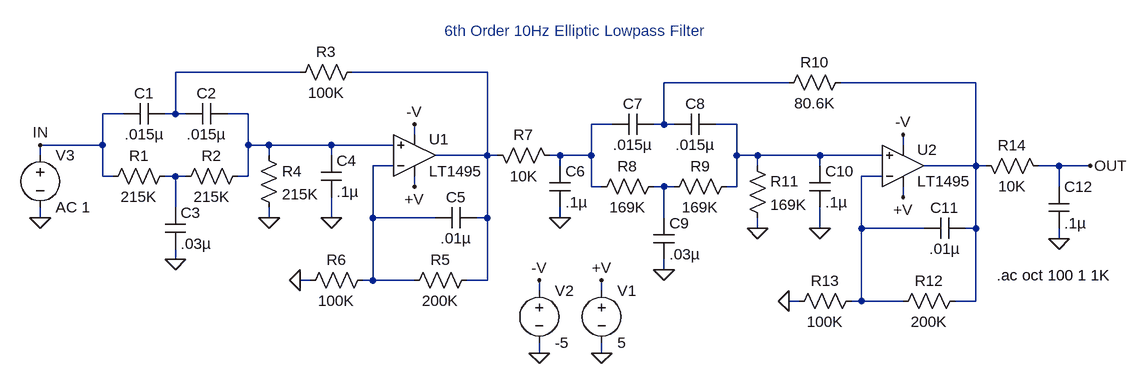
[diagram p0: schematic 1495.asc]
1495.asc, the LTspice schematic file:
Version 4
SHEET 1 1748 680
WIRE 144 -32 -48 -32
WIRE 432 -32 224 -32
WIRE 896 -16 704 -16
WIRE 1184 -16 976 -16
WIRE -128 32 -160 32
WIRE -48 32 -48 -32
WIRE -48 32 -64 32
WIRE -32 32 -48 32
WIRE 64 32 32 32
WIRE 624 48 592 48
WIRE 704 48 704 -16
WIRE 704 48 688 48
WIRE 720 48 704 48
WIRE 816 48 784 48
WIRE 320 64 320 48
WIRE -160 80 -160 32
WIRE -160 80 -256 80
WIRE 64 80 64 32
WIRE 96 80 64 80
WIRE 192 80 96 80
WIRE 288 80 192 80
WIRE 1072 80 1072 64
WIRE -256 96 -256 80
WIRE 96 96 96 80
WIRE 192 96 192 80
WIRE 432 96 432 -32
WIRE 432 96 352 96
WIRE 448 96 432 96
WIRE 544 96 528 96
WIRE 592 96 592 48
WIRE 592 96 544 96
WIRE 816 96 816 48
WIRE 848 96 816 96
WIRE 944 96 848 96
WIRE 1040 96 944 96
WIRE 288 112 256 112
WIRE 544 112 544 96
WIRE 848 112 848 96
WIRE 944 112 944 96
WIRE 1184 112 1184 -16
WIRE 1184 112 1104 112
WIRE 1200 112 1184 112
WIRE 1312 112 1280 112
WIRE 1360 112 1312 112
WIRE -160 128 -160 80
WIRE -144 128 -160 128
WIRE -48 128 -64 128
WIRE -32 128 -48 128
WIRE 64 128 64 80
WIRE 64 128 48 128
WIRE 1040 128 1008 128
WIRE 320 144 320 128
WIRE 592 144 592 96
WIRE 608 144 592 144
WIRE 704 144 688 144
WIRE 720 144 704 144
WIRE 816 144 816 96
WIRE 816 144 800 144
WIRE 1312 144 1312 112
WIRE 1072 160 1072 144
WIRE -48 176 -48 128
WIRE -256 192 -256 176
WIRE 96 192 96 176
WIRE 192 192 192 160
WIRE 256 192 256 112
WIRE 352 192 256 192
WIRE 432 192 432 96
WIRE 432 192 416 192
WIRE 544 192 544 176
WIRE 704 192 704 144
WIRE 848 208 848 192
WIRE 944 208 944 176
WIRE 1008 208 1008 128
WIRE 1104 208 1008 208
WIRE 1184 208 1184 112
WIRE 1184 208 1168 208
WIRE 1312 224 1312 208
WIRE -48 256 -48 240
WIRE 704 272 704 256
WIRE 160 288 144 288
WIRE 256 288 256 192
WIRE 256 288 240 288
WIRE 320 288 256 288
WIRE 432 288 432 192
WIRE 432 288 400 288
WIRE 512 304 512 288
WIRE 608 304 608 288
WIRE 912 320 896 320
WIRE 1008 320 1008 208
WIRE 1008 320 992 320
WIRE 1072 320 1008 320
WIRE 1184 320 1184 208
WIRE 1184 320 1152 320
WIRE 512 400 512 384
WIRE 608 400 608 384
FLAG 608 400 0
FLAG 320 144 +V
FLAG 608 288 +V
FLAG 320 48 -V
FLAG 512 400 0
FLAG 512 288 -V
FLAG -48 256 0
FLAG -256 192 0
FLAG 192 192 0
FLAG 96 192 0
FLAG 144 288 0
FLAG 1072 160 +V
FLAG 1072 64 -V
FLAG 704 272 0
FLAG 944 208 0
FLAG 848 208 0
FLAG 896 320 0
FLAG 1312 224 0
FLAG 1360 112 OUT
FLAG -256 80 IN
FLAG 544 192 0
SYMBOL voltage 608 288 R0
SYMATTR InstName V1
SYMATTR Value 5
SYMBOL voltage 512 288 R0
SYMATTR InstName V2
SYMATTR Value -5
SYMBOL cap -64 16 R90
WINDOW 0 0 32 VBottom 2
WINDOW 3 32 32 VTop 2
SYMATTR InstName C1
SYMATTR Value .015µ
SYMBOL cap 32 16 R90
WINDOW 0 0 32 VBottom 2
WINDOW 3 32 32 VTop 2
SYMATTR InstName C2
SYMATTR Value .015µ
SYMBOL res -48 112 R90
WINDOW 0 0 56 VBottom 2
WINDOW 3 32 56 VTop 2
SYMATTR InstName R1
SYMATTR Value 215K
SYMBOL res 64 112 R90
WINDOW 0 0 56 VBottom 2
WINDOW 3 32 56 VTop 2
SYMATTR InstName R2
SYMATTR Value 215K
SYMBOL cap -64 176 R0
SYMATTR InstName C3
SYMATTR Value .03µ
SYMBOL res 240 -48 R90
WINDOW 0 0 56 VBottom 2
WINDOW 3 32 56 VTop 2
SYMATTR InstName R3
SYMATTR Value 100K
SYMBOL res 80 80 R0
SYMATTR InstName R4
SYMATTR Value 215K
SYMBOL cap 176 96 R0
SYMATTR InstName C4
SYMATTR Value .1µ
SYMBOL res 416 272 R90
WINDOW 0 0 56 VBottom 2
WINDOW 3 32 56 VTop 2
SYMATTR InstName R5
SYMATTR Value 200K
SYMBOL res 256 272 R90
WINDOW 0 0 56 VBottom 2
WINDOW 3 32 56 VTop 2
SYMATTR InstName R6
SYMATTR Value 100K
SYMBOL cap 416 176 R90
WINDOW 0 0 32 VBottom 2
WINDOW 3 32 32 VTop 2
SYMATTR InstName C5
SYMATTR Value .01µ
SYMBOL voltage -256 80 R0
SYMATTR InstName V3
SYMATTR Value AC 1
SYMBOL res 432 80 M90
WINDOW 0 0 56 VBottom 2
WINDOW 3 32 56 VTop 2
SYMATTR InstName R7
SYMATTR Value 10K
SYMBOL cap 528 112 R0
SYMATTR InstName C6
SYMATTR Value .1µ
SYMBOL cap 688 32 R90
WINDOW 0 0 32 VBottom 2
WINDOW 3 32 32 VTop 2
SYMATTR InstName C7
SYMATTR Value .015µ
SYMBOL cap 784 32 R90
WINDOW 0 0 32 VBottom 2
WINDOW 3 32 32 VTop 2
SYMATTR InstName C8
SYMATTR Value .015µ
SYMBOL res 704 128 R90
WINDOW 0 0 56 VBottom 2
WINDOW 3 32 56 VTop 2
SYMATTR InstName R8
SYMATTR Value 169K
SYMBOL res 816 128 R90
WINDOW 0 0 56 VBottom 2
WINDOW 3 32 56 VTop 2
SYMATTR InstName R9
SYMATTR Value 169K
SYMBOL cap 688 192 R0
SYMATTR InstName C9
SYMATTR Value .03µ
SYMBOL res 992 -32 R90
WINDOW 0 0 56 VBottom 2
WINDOW 3 32 56 VTop 2
SYMATTR InstName R10
SYMATTR Value 80.6K
SYMBOL res 832 96 R0
SYMATTR InstName R11
SYMATTR Value 169K
SYMBOL cap 928 112 R0
SYMATTR InstName C10
SYMATTR Value .1µ
SYMBOL res 1168 304 R90
WINDOW 0 0 56 VBottom 2
WINDOW 3 32 56 VTop 2
SYMATTR InstName R12
SYMATTR Value 200K
SYMBOL res 1008 304 R90
WINDOW 0 0 56 VBottom 2
WINDOW 3 32 56 VTop 2
SYMATTR InstName R13
SYMATTR Value 100K
SYMBOL cap 1168 192 R90
WINDOW 0 0 32 VBottom 2
WINDOW 3 32 32 VTop 2
SYMATTR InstName C11
SYMATTR Value .01µ
SYMBOL res 1296 128 M270
WINDOW 0 32 56 VTop 2
WINDOW 3 0 56 VBottom 2
SYMATTR InstName R14
SYMATTR Value 10K
SYMBOL cap 1296 208 M180
WINDOW 0 24 64 Left 2
WINDOW 3 24 8 Left 2
SYMATTR InstName C12
SYMATTR Value .1µ
SYMBOL opamps\\LT1495 320 160 M180
WINDOW 0 22 89 Left 2
WINDOW 3 22 40 Left 2
SYMATTR InstName U1
SYMBOL opamps\\LT1495 1072 176 M180
WINDOW 0 22 89 Left 2
WINDOW 3 22 40 Left 2
SYMATTR InstName U2
TEXT 1216 280 Left 2 !.ac oct 100 1 1K
TEXT 568 -80 Bottom 2 ;6th Order 10Hz Elliptic Lowpass Filter

The netlist it stands for:
* 1495.asc
V1 +V 0 5
V2 -V 0 -5
C1 N001 IN .015µ
C2 N005 N001 .015µ
R1 N009 IN 215K
R2 N005 N009 215K
C3 N009 0 .03µ
R3 N002 N001 100K
R4 N005 0 215K
C4 N005 0 .1µ
R5 N002 N008 200K
R6 N008 0 100K
C5 N002 N008 .01µ
V3 IN 0 AC 1
R7 N002 N006 10K
C6 N006 0 .1µ
C7 N003 N006 .015µ
C8 N007 N003 .015µ
R8 N011 N006 169K
R9 N007 N011 169K
C9 N011 0 .03µ
R10 N004 N003 80.6K
R11 N007 0 169K
C10 N007 0 .1µ
R12 N004 N010 200K
R13 N010 0 100K
C11 N004 N010 .01µ
R14 OUT N004 10K
C12 0 OUT .1µ
XU1 N005 N008 +V -V N002 LT1495  ; pins In+ In- V+ V- OUT
XU2 N007 N010 +V -V N004 LT1495  ; pins In+ In- V+ V- OUT
.ac oct 100 1 1K
* 6th Order 10Hz Elliptic Lowpass Filter
.backanno
.end